# Altium schematic sheet USB-C_BREAKOUT_COMPONENTS.SchDoc
size Tabloid; DocumentNumber: 2; SheetNumber: 2; SheetTotal: 2; Sheet_Name: USB-C Breakout; Size: 11x17
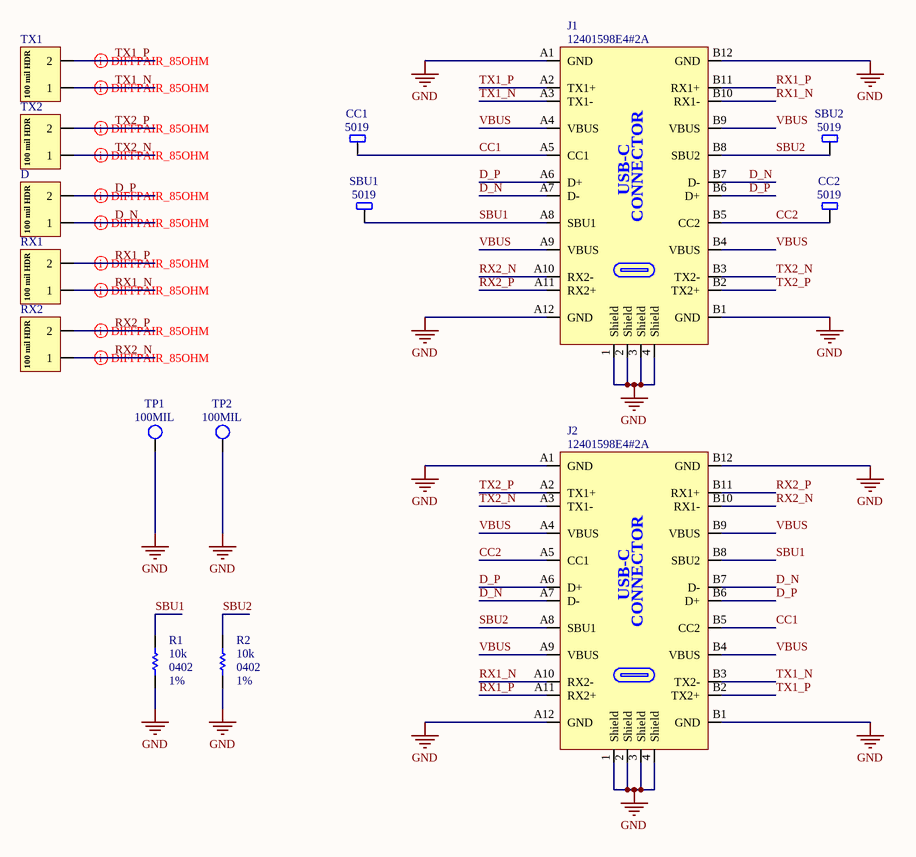
[diagram p0: USB-C_BREAKOUT_COMPONENTS.SchDoc]

## Parts
CC1  5019  [TPO_SMD_5019]
CC2  5019  [TPO_SMD_5019]
D  TS-102-G-A  [CON_HDR_TS-102-G-A]  (value not drawn)
J1  12401598E4#2A  [CON_USB_3.2_TypeC_12401598E4#2A]
J2  12401598E4#2A  [CON_USB_3.2_TypeC_12401598E4#2A]
R1  value 10k  Tolerance: 1%  Package: 0402  [RES_0402]  (hidden comment: RC0402FR-0710KL)
R2  value 10k  Tolerance: 1%  Package: 0402  [RES_0402]  (hidden comment: RC0402FR-0710KL)
RX1  TS-102-G-A  [CON_HDR_TS-102-G-A]  (value not drawn)
RX2  TS-102-G-A  [CON_HDR_TS-102-G-A]  (value not drawn)
SBU1  5019  [TPO_SMD_5019]
SBU2  5019  [TPO_SMD_5019]
TP1  100MIL  [TPO_TH_ROUND_100MIL]  (no BOM)
TP2  100MIL  [TPO_TH_ROUND_100MIL]  (no BOM)
TX1  TS-102-G-A  [CON_HDR_TS-102-G-A]  (value not drawn)
TX2  TS-102-G-A  [CON_HDR_TS-102-G-A]  (value not drawn)

## Nets
GND: J1.1(Shield) J1.2(Shield) J1.3(Shield) J1.4(Shield) J1.A1(GND) J1.A12(GND) J1.B1(GND) J1.B12(GND) J2.1(Shield) J2.2(Shield) J2.3(Shield) J2.4(Shield) J2.A1(GND) J2.A12(GND) J2.B1(GND) J2.B12(GND) R1.2 R2.2 TP1.1 TP2.1
CC1: CC1.1 J1.A5(CC1) J2.B5(CC2)
CC2: CC2.1 J1.B5(CC2) J2.A5(CC1)
D_N: D.1 J1.A7(D-) J1.B7(D-) J2.A7(D-) J2.B7(D-)
D_P: D.2 J1.A6(D+) J1.B6(D+) J2.A6(D+) J2.B6(D+)
RX1_N: J1.B10(RX1-) J2.A10(RX2-) RX1.1
RX1_P: J1.B11(RX1+) J2.A11(RX2+) RX1.2
RX2_N: J1.A10(RX2-) J2.B10(RX1-) RX2.1
RX2_P: J1.A11(RX2+) J2.B11(RX1+) RX2.2
SBU1: J1.A8(SBU1) J2.B8(SBU2) R1.1 SBU1.1
SBU2: J1.B8(SBU2) J2.A8(SBU1) R2.1 SBU2.1
TX1_N: J1.A3(TX1-) J2.B3(TX2-) TX1.1
TX1_P: J1.A2(TX1+) J2.B2(TX2+) TX1.2
TX2_N: J1.B3(TX2-) J2.A3(TX1-) TX2.1
TX2_P: J1.B2(TX2+) J2.A2(TX1+) TX2.2
VBUS: J1.A4(VBUS) J1.A9(VBUS) J1.B4(VBUS) J1.B9(VBUS) J2.A4(VBUS) J2.A9(VBUS) J2.B4(VBUS) J2.B9(VBUS)

## Layout directives
differential pair; differential pair class DIFF_85; net class DIFF: RX1_N, RX1_P, RX2_N, RX2_P, TX1_N, TX1_P, TX2_N, TX2_P
differential pair; differential pair class DIFF_85; net class DIFF_OTH: D_N, D_P

## Notes on the sheet
- Sheet Name
- Project Title
- Global Project
- Size
- Group
- Revision
- Date
- Sheet
- of
- Filename
- Designers
- (in symbol CON_HDR_TS-102-G-A) 100 mil HDR
- (in symbol CON_USB_3.2_TypeC_12401598E4#2A) USB-C; CONNECTOR

## Library data of the parts
CC1 CC2 SBU1 SBU2 = TPO_SMD_5019: TPO - PC TEST POINT MINI - SMD; Manufacturer #1: Keystone Electronics; Value: 3.81mm x 2.03mm; Polarized: No; Magnetic Material: UNKNOWN; GRAMS Lib Spec: 2.8; Current Rating: *; Manufacturer #2: *; Note: *; Power Max: *; Part Number #2: *; HelpURL: https://www.digikey.ca/product-detail/en/keystone-electronics/5019/36-5019CT-ND/3907344; Supplier 1: Digi-Key; Supplier Part Number 1: 36-5019CT-ND; Assembly Type: SMD; Part Number #1: 5019; Package: SMD; CreatedBy/Date: Olivier Bernard / 5/12/2017; Temperature: *; Tolerance: *; VerifiedBy: Caroline Paulin / 5 juillet 2018; Voltage Rating: *; Cryo: UNKNOWN
D RX1 RX2 TX1 TX2 = CON_HDR_TS-102-G-A: CON - HDR 2 position 0.100" - TH; Manufacturer #1: Samtec Inc.; GRAMS Lib Spec: 2.8; Magnetic Material: Unknown; Polarized: No; Assembly Type: TH; CreatedBy/Date: Joel Lemay 2018-06-19; Current Rating: *; HelpURL: http://suddendocs.samtec.com/prints/tx-1xx-x-x-mkt1.pdf; Manufacturer #2: *; Package: TH; Part Number #2: *; Power Max: *; Supplier 1: Digi-Key; Supplier Part Number 1: SAM1111-02-ND; Temperature: -55°C ~ 125°C; Tolerance: *; Value: *; VerifiedBy: Caroline Paulin - 10 sept 2018; Voltage Rating: *; Part Number #1: TS-102-G-A; Cryo: UNKNOWN
J1 J2 = CON_USB_3.2_TypeC_12401598E4#2A: CON_USB - USB 3.2 Gen 2 (USB 3.1 Gen 2, Superspeed + (USB 3.1)) 24 pos Receptacle - R/A; Manufacturer #1: Amphenol ICC (Commercial Products); Value: USB 3.2 Type C; Current Rating: 5A total; GRAMS Lib Spec: 2.8; Magnetic Material: Unknown; Polarized: Yes; Voltage Rating: -; Power Max: -; HelpURL: https://www.amphenol-icc.com/media/wysiwyg/files/drawing/12401598xxx2a.pdf; CreatedBy/Date: Louis-Daniel Gaulin / 07-04-2021; VerifiedBy: Philippe Arsenault/2021-04-08; Temperature: max 105°C; Package: SMD + TH R/A; Assembly Type: SMD + TH; Part Number #1: 12401598E4#2A; Supplier 1: Digi-Key; Supplier Part Number 1: 12401598E4#2ACT-ND
R1 R2 = RES_RC0402FR-0710KL: RES - 10K OHMS 1% 1/16W - 0402; Manufacturer #1: Yageo; GRAMS Lib Spec: 2.8; Magnetic Material: UNKNOWN; Polarized: NO; Voltage Rating: 50V; Assembly Type: SMD; CreatedBy/Date: Nicolas V. (2018-11-20); Current Rating: *; HelpURL: http://www.yageo.com/documents/recent/PYu-RC_Group_51_RoHS_L_9.pdf; Manufacturer #2: *; Note: *; Part Number #1: RC0402FR-0710KL; Part Number #2: *; Power Max: 1/16W; Temperature: -55°C ~ 155°C; VerifiedBy: Nicolas V. (2018-11-20); Supplier 1: Digi-Key; Supplier Part Number 1: 311-10.0KLRCT-ND; Cryo: UNKNOWN
TP1 TP2 = TPO_TH_ROUND_100MIL: TPO - TEST POINT ROUND TH  - 100MIL; Magnetic Material: NO; GRAMS Lib Spec: 2.8c; Cryo: UNKNOWN; Current Rating: *; Manufacturer #1: *; Manufacturer #2: *; Note: *; Power Max: *; Value: *; Part Number #1: *; Part Number #2: *; HelpURL: *; Polarized: *; Supplier 1: *; Assembly Type: NONE; Supplier Part Number 1: *; Package: 100 MIL round; CreatedBy/Date: Louis-Daniel Gaulin/ 14/01/2020; Temperature: *; Tolerance: *; VerifiedBy: C.Paulin - 21/01/2020; Voltage Rating: *